# EAGLE schematic xio4_mez (EAGLE 9.4.2)

## Sheet 1 of 6: Block diagram
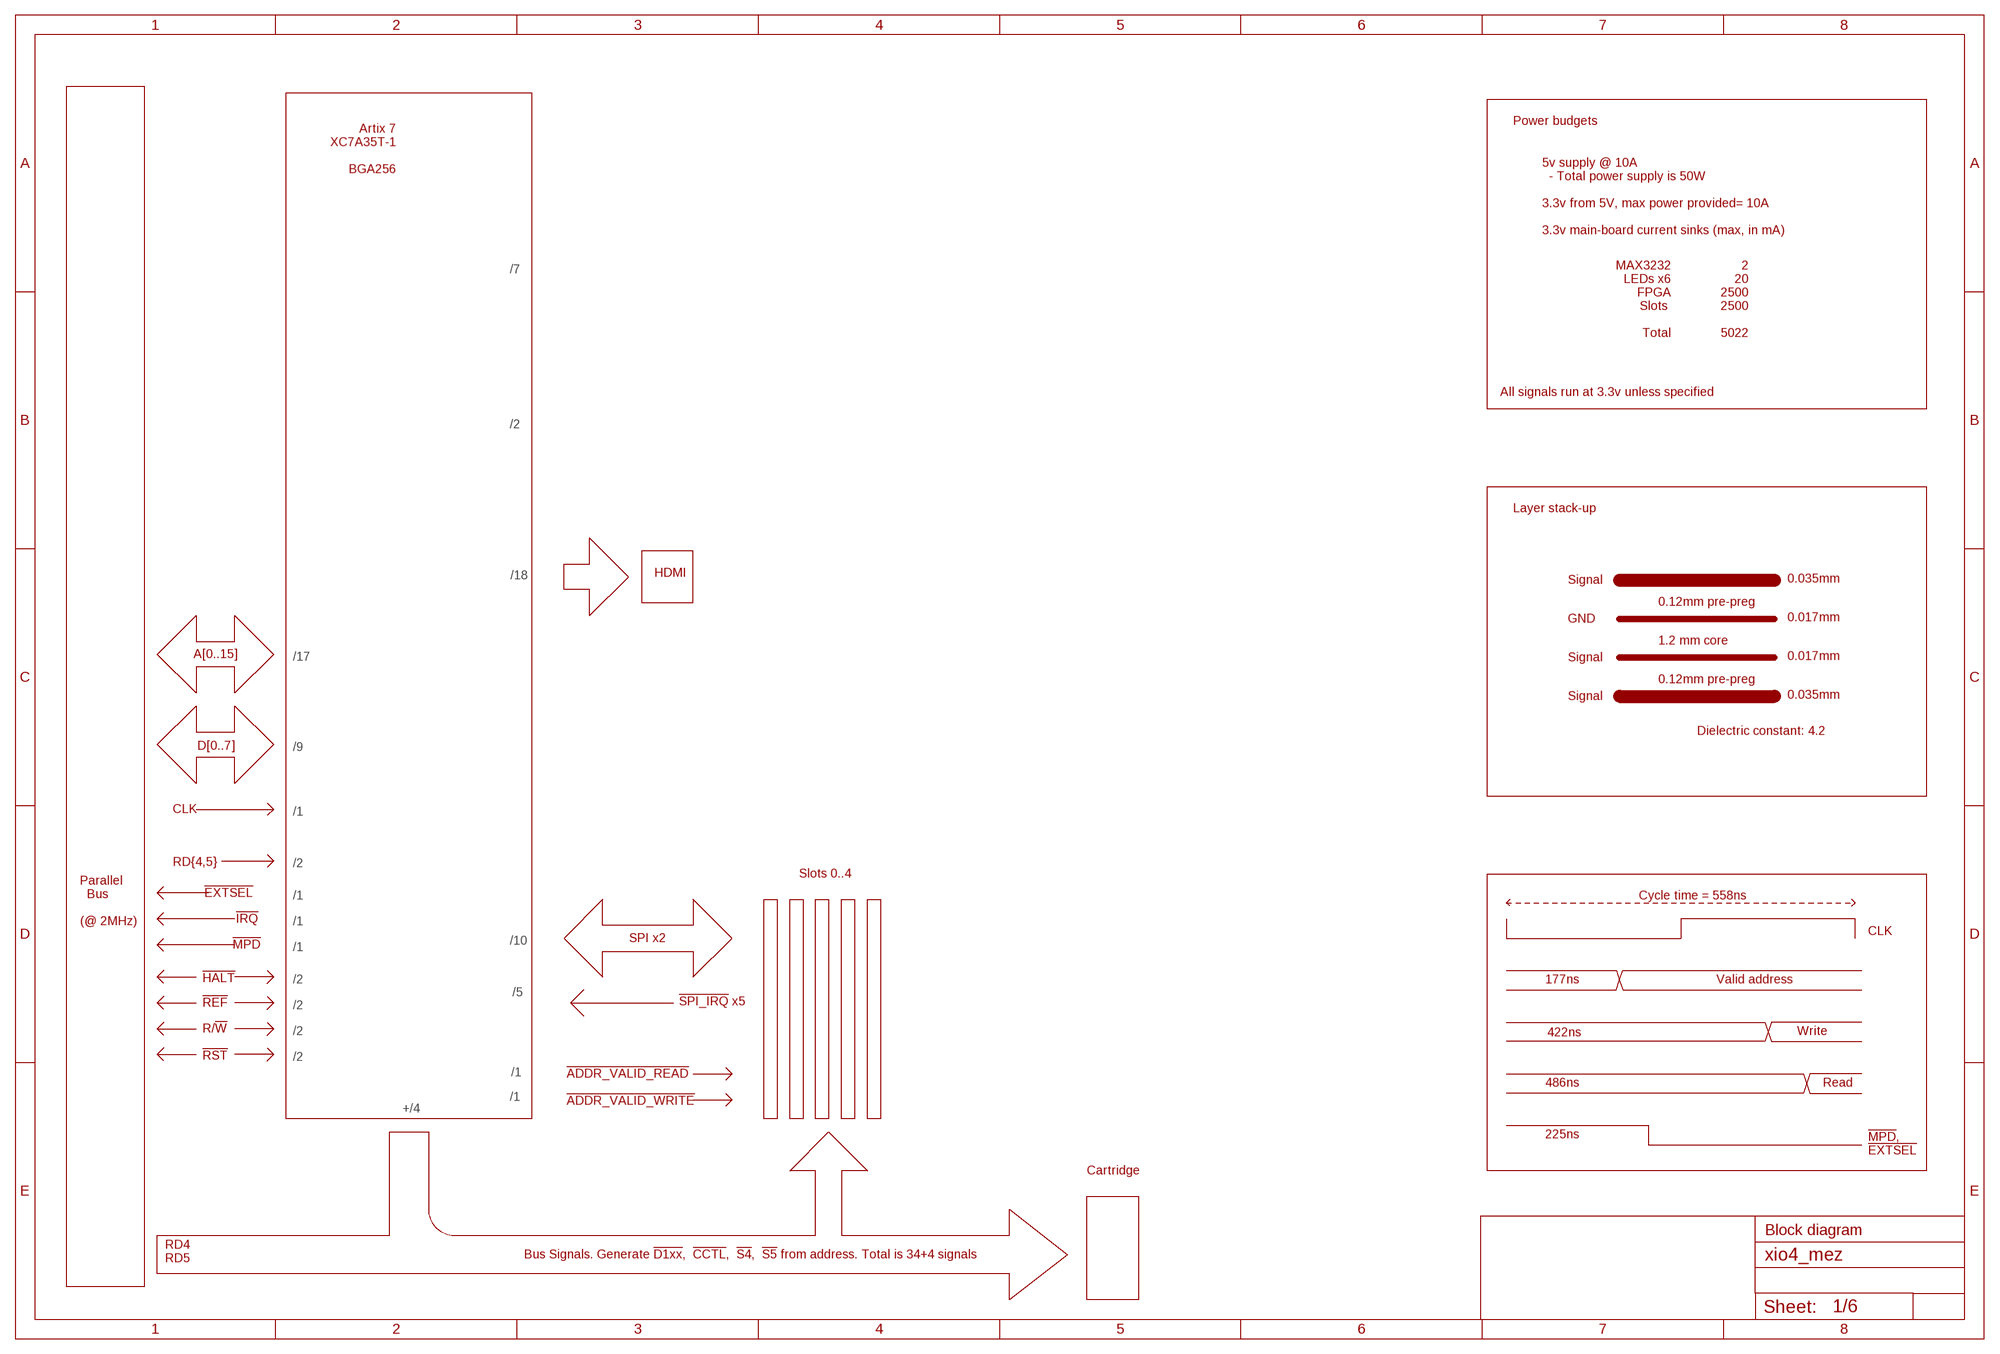
[diagram p0: schematic, sheet 1]

### Notes on the sheet
- Artix 7
      XC7A35T-1
  
   BGA256
- Power budgets
- 5v supply @ 10A
    - Total power supply is 50W
  
  3.3v from 5V, max power provided= 10A 
  
  3.3v main-board current sinks (max, in mA)
- MAX3232
  LEDs x6
  FPGA
  Slots 
  
  Total
- 2
  20
  2500
  2500
  
  5022
- /7
- All signals run at 3.3v unless specified
- /2
- Layer stack-up
- /18
- HDMI
- Signal | 0.035mm
- 0.12mm pre-preg
- GND | 0.017mm
- 1.2 mm core
- A[0..15] | /17 | Signal | 0.017mm
- 0.12mm pre-preg
- Signal | 0.035mm
- Dielectric constant: 4.2
- D[0..7] | /9
- CLK | /1
- RD{4,5} | /2
- Slots 0..4
- !EXTSEL!
- /1 | Cycle time = 558ns
- !IRQ!
- Parallel
    Bus
  
  (@ 2MHz)
- /1
- CLK
- !MPD! | SPI x2
- /10
- /1
- !HALT! | /2 | 177ns | Valid address
- /5
- !REF! | !SPI_IRQ! x5
- /2
- R/!W! | /2 | Write
- 422ns
- !RST! | /2
- /1 | !ADDR_VALID_READ!
- 486ns | Read
- /1
- !ADDR_VALID_WRITE!
- +/4
- 225ns
- !MPD!,
  !EXTSEL!
- Cartridge
- Block diagram
- Bus Signals. Generate !D1xx!,  !CCTL!,  !S4!,  !S5! from address. Total is 34+4 signals
- RD4
  RD5

## Sheet 2 of 6: High voltage signalling
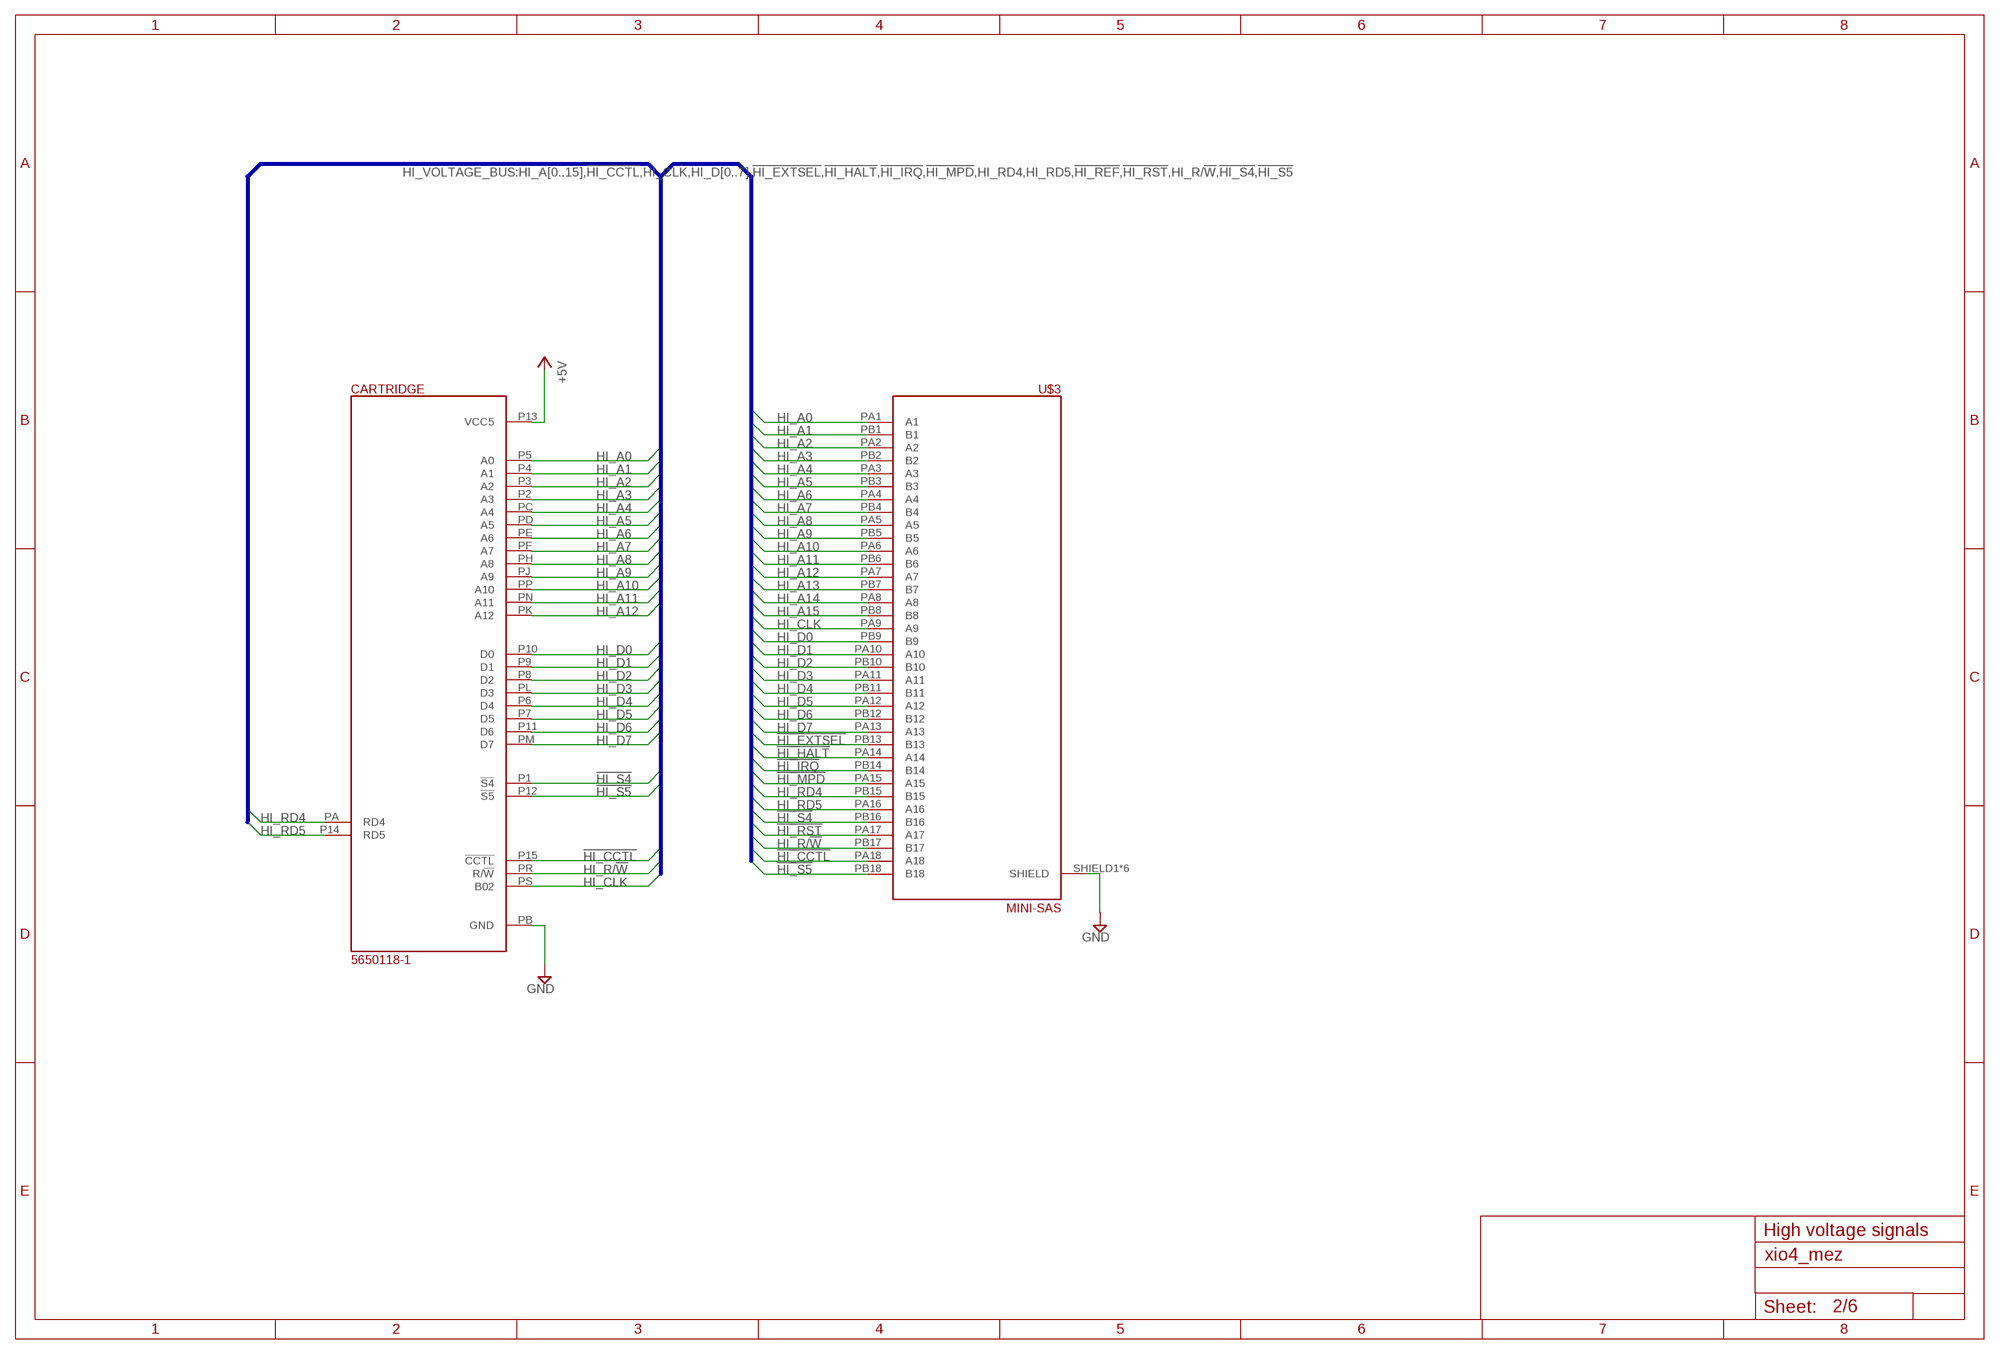
[diagram p1: schematic, sheet 2]

### Parts
CARTRIDGE  5650118-1  A8_CART  [A8_CART]
U$3  MINI-SAS  [MINI-SAS]

### Nets
!HI_CCTL!: CARTRIDGE.P15(!CCTL!) U$3.PA18(A18)
!HI_EXTSEL!: U$3.PB13(B13) ; also sheet 3
!HI_HALT!: U$3.PA14(A14) ; also sheet 3
!HI_IRQ!: U$3.PB14(B14) ; also sheet 3
!HI_MPD!: U$3.PA15(A15) ; also sheet 3
!HI_RST!: U$3.PA17(A17) ; also sheet 3
!HI_S4!: CARTRIDGE.P1(!S4!) U$3.PB16(B16)
!HI_S5!: CARTRIDGE.P12(!S5!) U$3.PB18(B18)
+5V: CARTRIDGE.P13(VCC5) ; also sheet 3,4,5,6
GND: CARTRIDGE.PB(GND) U$3.SHIELD1(SHIELD) U$3.SHIELD2(SHIELD) U$3.SHIELD3(SHIELD) U$3.SHIELD4(SHIELD) U$3.SHIELD5(SHIELD) U$3.SHIELD6(SHIELD) ; also sheet 3,4,5
HI_A0: CARTRIDGE.P5(A0) U$3.PA1(A1) ; also sheet 3
HI_A1: CARTRIDGE.P4(A1) U$3.PB1(B1) ; also sheet 3
HI_A2: CARTRIDGE.P3(A2) U$3.PA2(A2) ; also sheet 3
HI_A3: CARTRIDGE.P2(A3) U$3.PB2(B2) ; also sheet 3
HI_A4: CARTRIDGE.PC(A4) U$3.PA3(A3) ; also sheet 3
HI_A5: CARTRIDGE.PD(A5) U$3.PB3(B3) ; also sheet 3
HI_A6: CARTRIDGE.PE(A6) U$3.PA4(A4) ; also sheet 3
HI_A7: CARTRIDGE.PF(A7) U$3.PB4(B4) ; also sheet 3
HI_A8: CARTRIDGE.PH(A8) U$3.PA5(A5) ; also sheet 3
HI_A9: CARTRIDGE.PJ(A9) U$3.PB5(B5) ; also sheet 3
HI_A10: CARTRIDGE.PP(A10) U$3.PA6(A6) ; also sheet 3
HI_A11: CARTRIDGE.PN(A11) U$3.PB6(B6) ; also sheet 3
HI_A12: CARTRIDGE.PK(A12) U$3.PA7(A7) ; also sheet 3
HI_A13: U$3.PB7(B7) ; also sheet 3
HI_A14: U$3.PA8(A8) ; also sheet 3
HI_A15: U$3.PB8(B8) ; also sheet 3
HI_CLK: CARTRIDGE.PS(B02) U$3.PA9(A9) ; also sheet 3
HI_D0: CARTRIDGE.P10(D0) U$3.PB9(B9) ; also sheet 3
HI_D1: CARTRIDGE.P9(D1) U$3.PA10(A10) ; also sheet 3
HI_D2: CARTRIDGE.P8(D2) U$3.PB10(B10) ; also sheet 3
HI_D3: CARTRIDGE.PL(D3) U$3.PA11(A11) ; also sheet 3
HI_D4: CARTRIDGE.P6(D4) U$3.PB11(B11) ; also sheet 3
HI_D5: CARTRIDGE.P7(D5) U$3.PA12(A12) ; also sheet 3
HI_D6: CARTRIDGE.P11(D6) U$3.PB12(B12) ; also sheet 3
HI_D7: CARTRIDGE.PM(D7) U$3.PA13(A13) ; also sheet 3
HI_R/!W!: CARTRIDGE.PR(R/!W!) U$3.PB17(B17) ; also sheet 3
HI_RD4: CARTRIDGE.PA(RD4) U$3.PB15(B15) ; also sheet 3
HI_RD5: CARTRIDGE.P14(RD5) U$3.PA16(A16) ; also sheet 3

### Buses
HI_VOLTAGE_BUS:HI_A[0..15],!HI_CCTL!,HI_CLK,HI_D[0..7],!HI_EXTSEL!,!HI_HALT!,!HI_IRQ!,!HI_MPD!,HI_RD4,HI_RD5,!HI_REF!,!HI_RST!,HI_R/!W!,!HI_S4!,!HI_S5!

### Notes on the sheet
- High voltage signals

## Sheet 3 of 6: Level changers
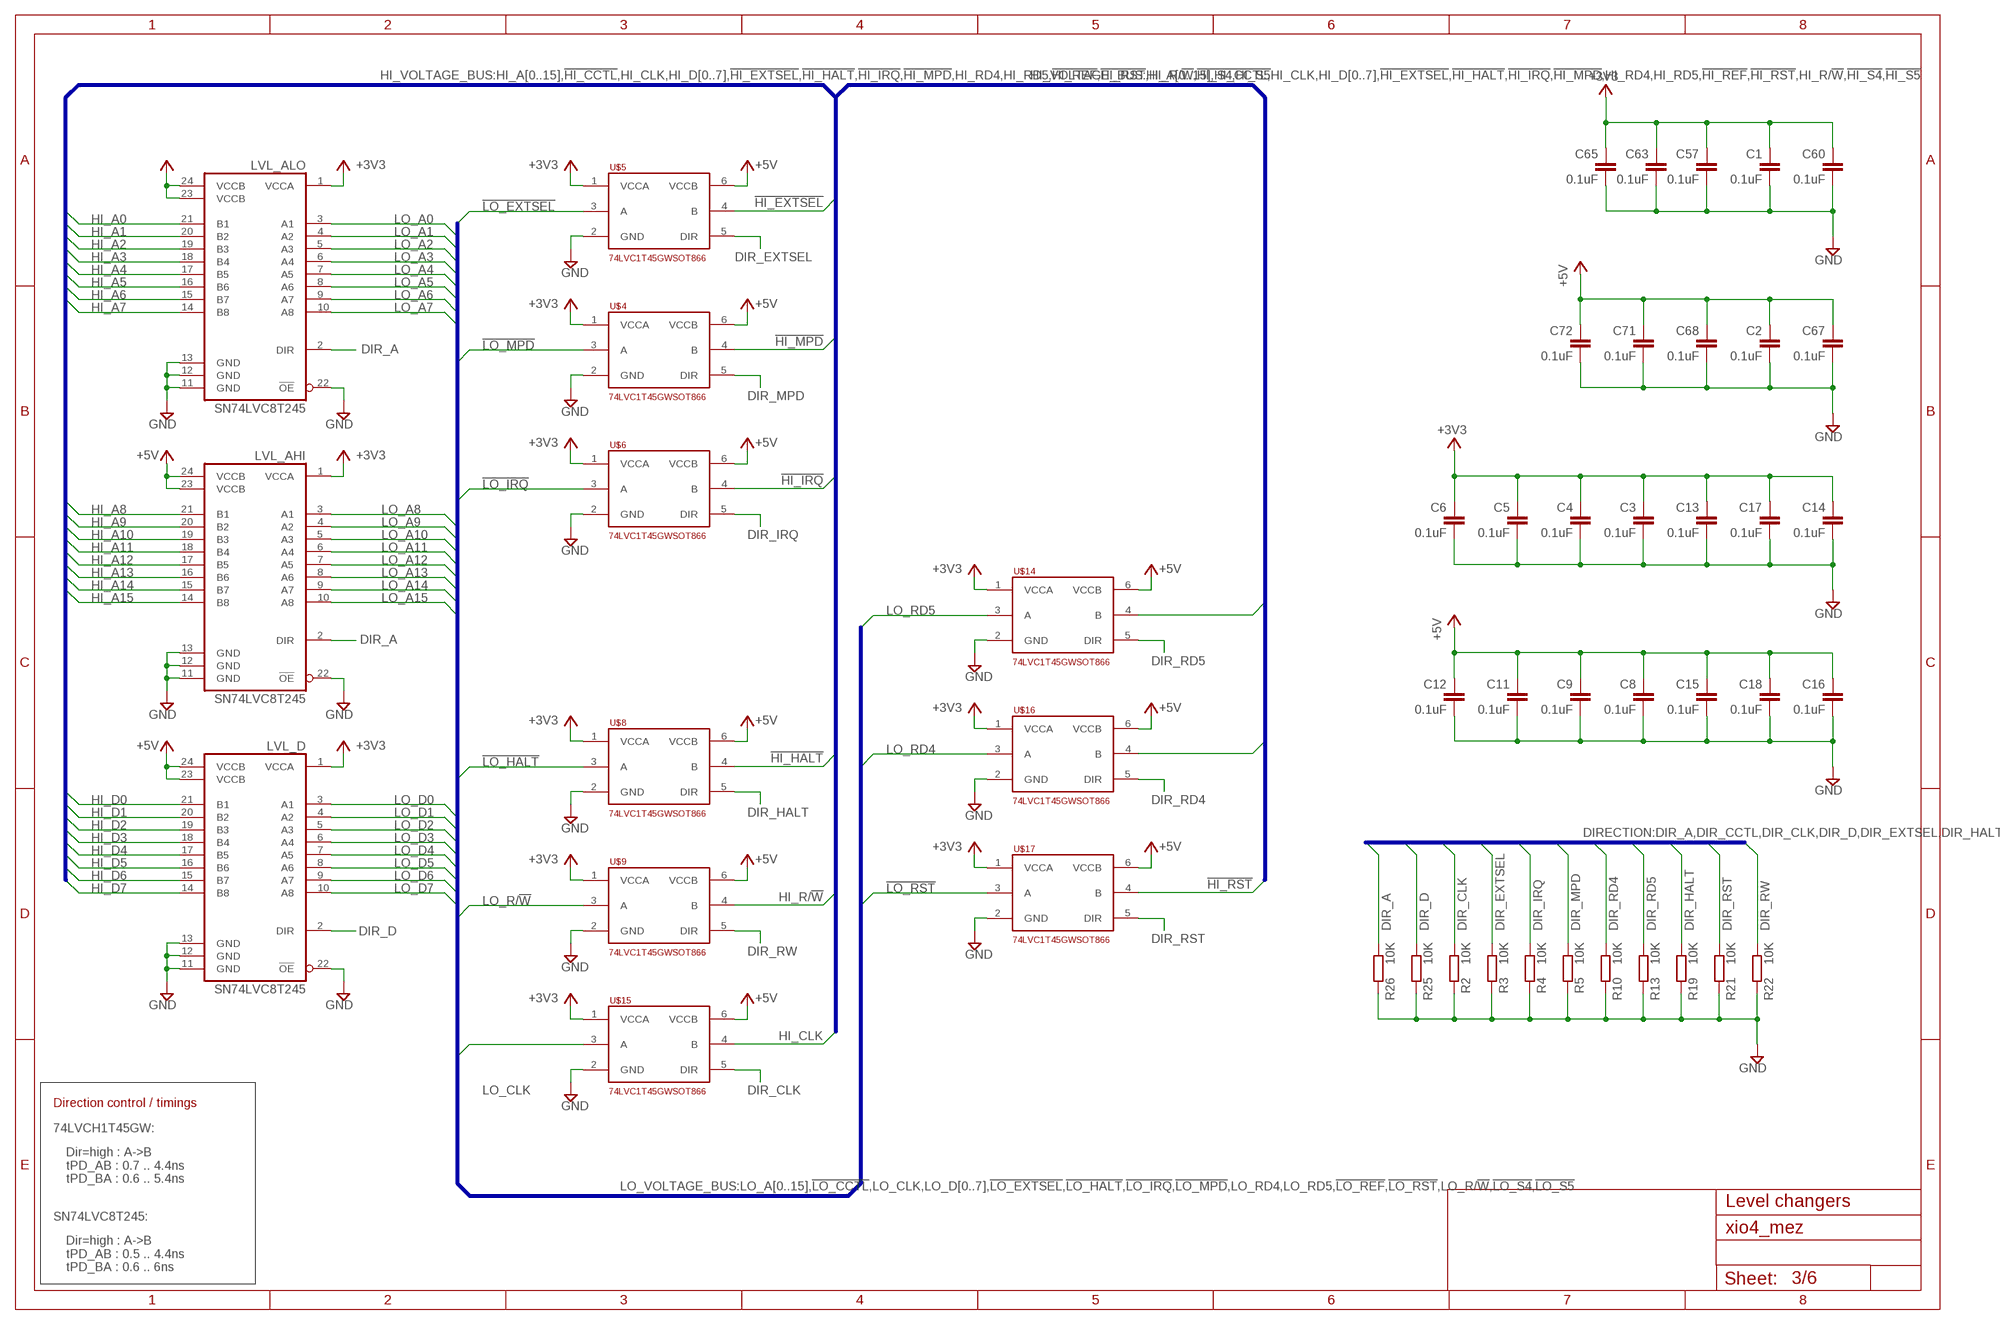
[diagram p2: schematic, sheet 3, part 1 of 2]
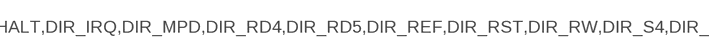
[diagram p3: schematic, sheet 3, part 2 of 2]

### Parts
C1  0.1uF  C-EUC0201  [C0201]
C2  0.1uF  C-EUC0201  [C0201]
C3  0.1uF  C-EUC0201  [C0201]
C4  0.1uF  C-EUC0201  [C0201]
C5  0.1uF  C-EUC0201  [C0201]
C6  0.1uF  C-EUC0201  [C0201]
C8  0.1uF  C-EUC0201  [C0201]
C9  0.1uF  C-EUC0201  [C0201]
C11  0.1uF  C-EUC0201  [C0201]
C12  0.1uF  C-EUC0201  [C0201]
C13  0.1uF  C-EUC0201  [C0201]
C14  0.1uF  C-EUC0201  [C0201]
C15  0.1uF  C-EUC0201  [C0201]
C16  0.1uF  C-EUC0201  [C0201]
C17  0.1uF  C-EUC0201  [C0201]
C18  0.1uF  C-EUC0201  [C0201]
C57  0.1uF  C-EUC0201  [C0201]
C60  0.1uF  C-EUC0201  [C0201]
C63  0.1uF  C-EUC0201  [C0201]
C65  0.1uF  C-EUC0201  [C0201]
C67  0.1uF  C-EUC0201  [C0201]
C68  0.1uF  C-EUC0201  [C0201]
C71  0.1uF  C-EUC0201  [C0201]
C72  0.1uF  C-EUC0201  [C0201]
LVL_AHI  SN74LVC8T245  [TSSOP24]
LVL_ALO  SN74LVC8T245  [TSSOP24]
LVL_D  SN74LVC8T245  [TSSOP24]
R2  10K  R-EU_R0201  [R0201]
R3  10K  R-EU_R0201  [R0201]
R4  10K  R-EU_R0201  [R0201]
R5  10K  R-EU_R0201  [R0201]
R10  10K  R-EU_R0201  [R0201]
R13  10K  R-EU_R0201  [R0201]
R19  10K  R-EU_R0201  [R0201]
R21  10K  R-EU_R0201  [R0201]
R22  10K  R-EU_R0201  [R0201]
R25  10K  R-EU_R0201  [R0201]
R26  10K  R-EU_R0201  [R0201]
U$4  74LVC1T45GWSOT866  [SOT886]
U$5  74LVC1T45GWSOT866  [SOT886]
U$6  74LVC1T45GWSOT866  [SOT886]
U$8  74LVC1T45GWSOT866  [SOT886]
U$9  74LVC1T45GWSOT866  [SOT886]
U$14  74LVC1T45GWSOT866  [SOT886]
U$15  74LVC1T45GWSOT866  [SOT886]
U$16  74LVC1T45GWSOT866  [SOT886]
U$17  74LVC1T45GWSOT866  [SOT886]

### Nets
!HI_EXTSEL!: U$5.4(B) ; also sheet 2
!HI_HALT!: U$8.4(B) ; also sheet 2
!HI_IRQ!: U$6.4(B) ; also sheet 2
!HI_MPD!: U$4.4(B) ; also sheet 2
!HI_RST!: U$17.4(B) ; also sheet 2
!LO_EXTSEL!: U$5.3(A) ; also sheet 6
!LO_HALT!: U$8.3(A) ; also sheet 6
!LO_IRQ!: U$6.3(A) ; also sheet 6
!LO_MPD!: U$4.3(A) ; also sheet 6
!LO_RST!: U$17.3(A) ; also sheet 6
+3V3 [lcd]: C1.1 C3.1 C4.1 C5.1 C6.1 C13.1 C14.1 C17.1 C57.1 C60.1 C63.1 C65.1 LVL_AHI.1(VCCA) LVL_ALO.1(VCCA) LVL_D.1(VCCA) U$4.1(VCCA) U$5.1(VCCA) U$6.1(VCCA) U$8.1(VCCA) U$9.1(VCCA) U$14.1(VCCA) U$15.1(VCCA) U$16.1(VCCA) U$17.1(VCCA)
+5V: C2.1 C8.1 C9.1 C11.1 C12.1 C15.1 C16.1 C18.1 C67.1 C68.1 C71.1 C72.1 LVL_AHI.23(VCCB) LVL_AHI.24(VCCB) LVL_ALO.23(VCCB) LVL_ALO.24(VCCB) LVL_D.23(VCCB) LVL_D.24(VCCB) U$4.6(VCCB) U$5.6(VCCB) U$6.6(VCCB) U$8.6(VCCB) U$9.6(VCCB) U$14.6(VCCB) U$15.6(VCCB) U$16.6(VCCB) U$17.6(VCCB) ; also sheet 2,4,5,6
DIR_A: LVL_AHI.2(DIR) LVL_ALO.2(DIR) R26.1 ; also sheet 5
DIR_CLK: R2.1 U$15.5(DIR) ; also sheet 5
DIR_D: LVL_D.2(DIR) R25.1 ; also sheet 5
DIR_EXTSEL: R3.1 U$5.5(DIR) ; also sheet 5
DIR_HALT: R19.1 U$8.5(DIR) ; also sheet 5
DIR_IRQ: R4.1 U$6.5(DIR) ; also sheet 5
DIR_MPD: R5.1 U$4.5(DIR) ; also sheet 5
DIR_RD4: R10.1 U$16.5(DIR) ; also sheet 5
DIR_RD5: R13.1 U$14.5(DIR) ; also sheet 5
DIR_RST: R21.1 U$17.5(DIR) ; also sheet 5
DIR_RW: R22.1 U$9.5(DIR) ; also sheet 5
GND: C1.2 C2.2 C3.2 C4.2 C5.2 C6.2 C8.2 C9.2 C11.2 C12.2 C13.2 C14.2 C15.2 C16.2 C17.2 C18.2 C57.2 C60.2 C63.2 C65.2 C67.2 C68.2 C71.2 C72.2 LVL_AHI.11(GND) LVL_AHI.12(GND) LVL_AHI.13(GND) LVL_AHI.22(!OE!) LVL_ALO.11(GND) LVL_ALO.12(GND) LVL_ALO.13(GND) LVL_ALO.22(!OE!) LVL_D.11(GND) LVL_D.12(GND) LVL_D.13(GND) LVL_D.22(!OE!) R2.2 R3.2 R4.2 R5.2 R10.2 R13.2 R19.2 R21.2 R22.2 R25.2 R26.2 U$4.2(GND) U$5.2(GND) U$6.2(GND) U$8.2(GND) U$9.2(GND) U$14.2(GND) U$15.2(GND) U$16.2(GND) U$17.2(GND) ; also sheet 2,4,5
HI_A0: LVL_ALO.21(B1) ; also sheet 2
HI_A1: LVL_ALO.20(B2) ; also sheet 2
HI_A2: LVL_ALO.19(B3) ; also sheet 2
HI_A3: LVL_ALO.18(B4) ; also sheet 2
HI_A4: LVL_ALO.17(B5) ; also sheet 2
HI_A5: LVL_ALO.16(B6) ; also sheet 2
HI_A6: LVL_ALO.15(B7) ; also sheet 2
HI_A7: LVL_ALO.14(B8) ; also sheet 2
HI_A8: LVL_AHI.21(B1) ; also sheet 2
HI_A9: LVL_AHI.20(B2) ; also sheet 2
HI_A10: LVL_AHI.19(B3) ; also sheet 2
HI_A11: LVL_AHI.18(B4) ; also sheet 2
HI_A12: LVL_AHI.17(B5) ; also sheet 2
HI_A13: LVL_AHI.16(B6) ; also sheet 2
HI_A14: LVL_AHI.15(B7) ; also sheet 2
HI_A15: LVL_AHI.14(B8) ; also sheet 2
HI_CLK: U$15.4(B) ; also sheet 2
HI_D0: LVL_D.21(B1) ; also sheet 2
HI_D1: LVL_D.20(B2) ; also sheet 2
HI_D2: LVL_D.19(B3) ; also sheet 2
HI_D3: LVL_D.18(B4) ; also sheet 2
HI_D4: LVL_D.17(B5) ; also sheet 2
HI_D5: LVL_D.16(B6) ; also sheet 2
HI_D6: LVL_D.15(B7) ; also sheet 2
HI_D7: LVL_D.14(B8) ; also sheet 2
HI_R/!W!: U$9.4(B) ; also sheet 2
HI_RD4: U$16.4(B) ; also sheet 2
HI_RD5: U$14.4(B) ; also sheet 2
LO_A0: LVL_ALO.3(A1) ; also sheet 6
LO_A1: LVL_ALO.4(A2) ; also sheet 6
LO_A2: LVL_ALO.5(A3) ; also sheet 6
LO_A3: LVL_ALO.6(A4) ; also sheet 6
LO_A4: LVL_ALO.7(A5) ; also sheet 6
LO_A5: LVL_ALO.8(A6) ; also sheet 6
LO_A6: LVL_ALO.9(A7) ; also sheet 6
LO_A7: LVL_ALO.10(A8) ; also sheet 6
LO_A8: LVL_AHI.3(A1) ; also sheet 6
LO_A9: LVL_AHI.4(A2) ; also sheet 6
LO_A10: LVL_AHI.5(A3) ; also sheet 6
LO_A11: LVL_AHI.6(A4) ; also sheet 6
LO_A12: LVL_AHI.7(A5) ; also sheet 6
LO_A13: LVL_AHI.8(A6) ; also sheet 6
LO_A14: LVL_AHI.9(A7) ; also sheet 6
LO_A15: LVL_AHI.10(A8) ; also sheet 6
LO_CLK: U$15.3(A) ; also sheet 6
LO_D0: LVL_D.3(A1) ; also sheet 6
LO_D1: LVL_D.4(A2) ; also sheet 6
LO_D2: LVL_D.5(A3) ; also sheet 6
LO_D3: LVL_D.6(A4) ; also sheet 6
LO_D4: LVL_D.7(A5) ; also sheet 6
LO_D5: LVL_D.8(A6) ; also sheet 6
LO_D6: LVL_D.9(A7) ; also sheet 6
LO_D7: LVL_D.10(A8) ; also sheet 6
LO_R/!W!: U$9.3(A) ; also sheet 6
LO_RD4: U$16.3(A) ; also sheet 6
LO_RD5: U$14.3(A) ; also sheet 6

### Buses
HI_VOLTAGE_BUS:HI_A[0..15],!HI_CCTL!,HI_CLK,HI_D[0..7],!HI_EXTSEL!,!HI_HALT!,!HI_IRQ!,!HI_MPD!,HI_RD4,HI_RD5,!HI_REF!,!HI_RST!,HI_R/!W!,!HI_S4!,!HI_S5!
LO_VOLTAGE_BUS:LO_A[0..15],!LO_CCTL!,LO_CLK,LO_D[0..7],!LO_EXTSEL!,!LO_HALT!,!LO_IRQ!,!LO_MPD!,LO_RD4,LO_RD5,!LO_REF!,!LO_RST!,LO_R/!W!,!LO_S4!,!LO_S5!
DIRECTION:DIR_A,DIR_CCTL,DIR_CLK,DIR_D,DIR_EXTSEL,DIR_HALT,DIR_IRQ,DIR_MPD,DIR_RD4,DIR_RD5,DIR_REF,DIR_RST,DIR_RW,DIR_S4,DIR_S5

### Notes on the sheet
- Direction control / timings
- 74LVCH1T45GW:
- Dir=high : A->B
  tPD_AB : 0.7 .. 4.4ns
  tPD_BA : 0.6 .. 5.4ns
- Level changers
- SN74LVC8T245:
- Dir=high : A->B
  tPD_AB : 0.5 .. 4.4ns
  tPD_BA : 0.6 .. 6ns

## Sheet 4 of 6: Video out
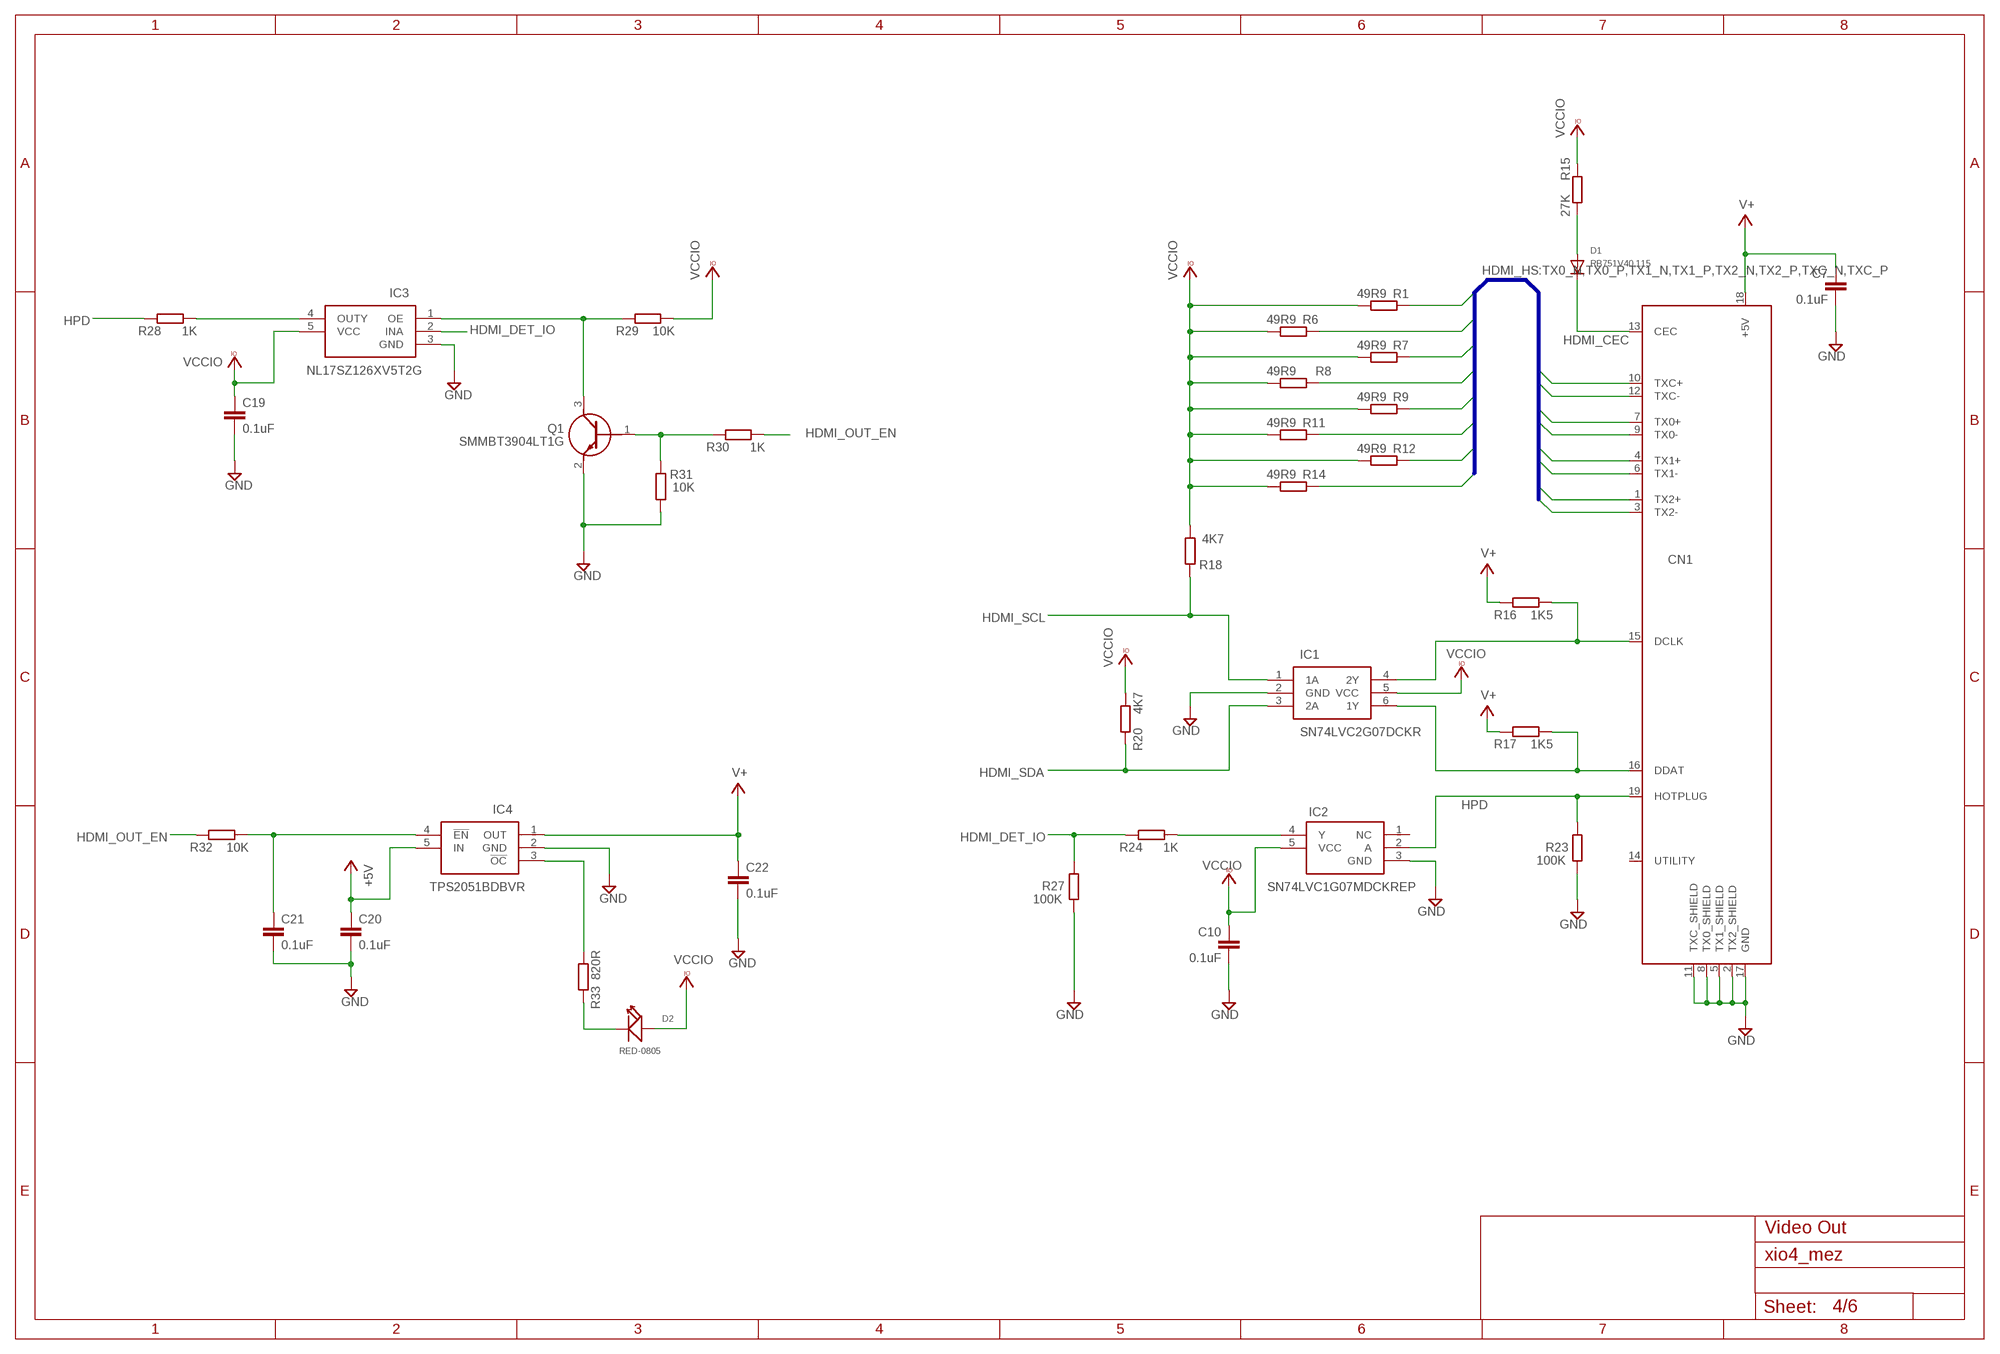
[diagram p4: schematic, sheet 4]

### Parts
C7  0.1uF  C-EUC0201  [C0201]
C10  0.1uF  C-EUC0201  [C0201]
C19  0.1uF  C-EUC0201  [C0201]
C20  0.1uF  C-EUC0201  [C0201]
C21  0.1uF  C-EUC0201  [C0201]
C22  0.1uF  C-EUC0201  [C0201]
CN1  HDMI_MOLEX_47151-0001  [HDMI_MOLEX_47151-0001]
D1  RB751V40,115  DIODESOD-323  [SOD-323]
D2  RED-0805  SMD-LED-CLEAR-RED(0805)  [LED-0805]
IC1  SN74LVC2G07DCKR  [SOT65P210X110X6N]
IC2  SN74LVC1G07MDCKREP  [SOT65P210X110-5N]
IC3  NL17SZ126XV5T2G  [SOTFL50P160X60-5N]
IC4  TPS2051BDBVR  [SOT95P280X145-5N]
Q1  SMMBT3904LT1G  [SOT96P237X111-3N]
R1  49R9  R-EU_R0201  [R0201]
R6  49R9  R-EU_R0201  [R0201]
R7  49R9  R-EU_R0201  [R0201]
R8  49R9  R-EU_R0201  [R0201]
R9  49R9  R-EU_R0201  [R0201]
R11  49R9  R-EU_R0201  [R0201]
R12  49R9  R-EU_R0201  [R0201]
R14  49R9  R-EU_R0201  [R0201]
R15  27K  R-EU_R0201  [R0201]
R16  1K5  R-EU_R0201  [R0201]
R17  1K5  R-EU_R0201  [R0201]
R18  4K7  R-EU_R0201  [R0201]
R20  4K7  R-EU_R0201  [R0201]
R23  100K  R-EU_R0201  [R0201]
R24  1K  R-EU_R0201  [R0201]
R27  100K  R-EU_R0201  [R0201]
R28  1K  R-EU_R0201  [R0201]
R29  10K  R-EU_R0201  [R0201]
R30  1K  R-EU_R0201  [R0201]
R31  10K  R-EU_R0201  [R0201]
R32  10K  R-EU_R0201  [R0201]
R33  820R  R-EU_R0201  [R0201]

### Nets
+5V: C20.1 IC4.5(IN) ; also sheet 2,3,5,6
GND: C7.2 C10.2 C19.2 C20.2 C21.2 C22.2 CN1.2(TX2_SHIELD) CN1.5(TX1_SHIELD) CN1.8(TX0_SHIELD) CN1.11(TXC_SHIELD) CN1.17(GND) IC1.2(GND) IC2.3(GND) IC3.3(GND) IC4.2(GND) Q1.2(E) R23.1 R27.1 R31.2 ; also sheet 2,3,5
HDMI_CEC: CN1.13(CEC) D1.C
HDMI_DET_IO: IC3.2(INA) R24.2 R27.2 ; also sheet 5
HDMI_OUT_EN: R30.1 R32.2 ; also sheet 5
HDMI_SCL: IC1.1(1A) R18.2 ; also sheet 5
HDMI_SDA: IC1.3(2A) R20.2 ; also sheet 5
HPD: CN1.19(HOTPLUG) IC2.2(A) R23.2 R28.2
N$1: CN1.16(DDAT) IC1.6(1Y) R17.1
N$2: D1.A R15.1
N$3: CN1.15(DCLK) IC1.4(2Y) R16.1
N$4: IC3.1(OE) Q1.3(C) R29.2
N$5: IC2.4(Y) R24.1
N$6: IC3.4(OUTY) R28.1
N$7: Q1.1(B) R30.2 R31.1
N$8: C21.1 IC4.4(!EN) R32.1
N$9: IC4.3(!OC) R33.1
N$10: D2.- R33.2
TX0_N [tx100]: CN1.9(TX0-) R1.2 ; also sheet 5
TX0_P [tx100]: CN1.7(TX0+) R6.2 ; also sheet 5
TX1_N [tx100]: CN1.6(TX1-) R7.2 ; also sheet 5
TX1_P [tx100]: CN1.4(TX1+) R8.2 ; also sheet 5
TX2_N [tx100]: CN1.3(TX2-) R9.2 ; also sheet 5
TX2_P [tx100]: CN1.1(TX2+) R11.2 ; also sheet 5
TXC_N [tx100]: CN1.12(TXC-) R12.2 ; also sheet 5
TXC_P [tx100]: CN1.10(TXC+) R14.2 ; also sheet 5
V+: C7.1 C22.1 CN1.18(+5V) IC4.1(OUT) R16.2 R17.2
VCCIO: C10.1 C19.1 D2.+ IC1.5(VCC) IC2.5(VCC) IC3.5(VCC) R1.1 R6.1 R7.1 R8.1 R9.1 R11.1 R12.1 R14.1 R15.2 R18.1 R20.1 R29.1 ; also sheet 5
Unconnected: CN1.14(UTILITY) IC2.1(NC)

### Buses
HDMI_HS:TX0_N,TX0_P,TX1_N,TX1_P,TX2_N,TX2_P,TXC_N,TXC_P

### Notes on the sheet
- Video Out

## Sheet 5 of 6: FPGA
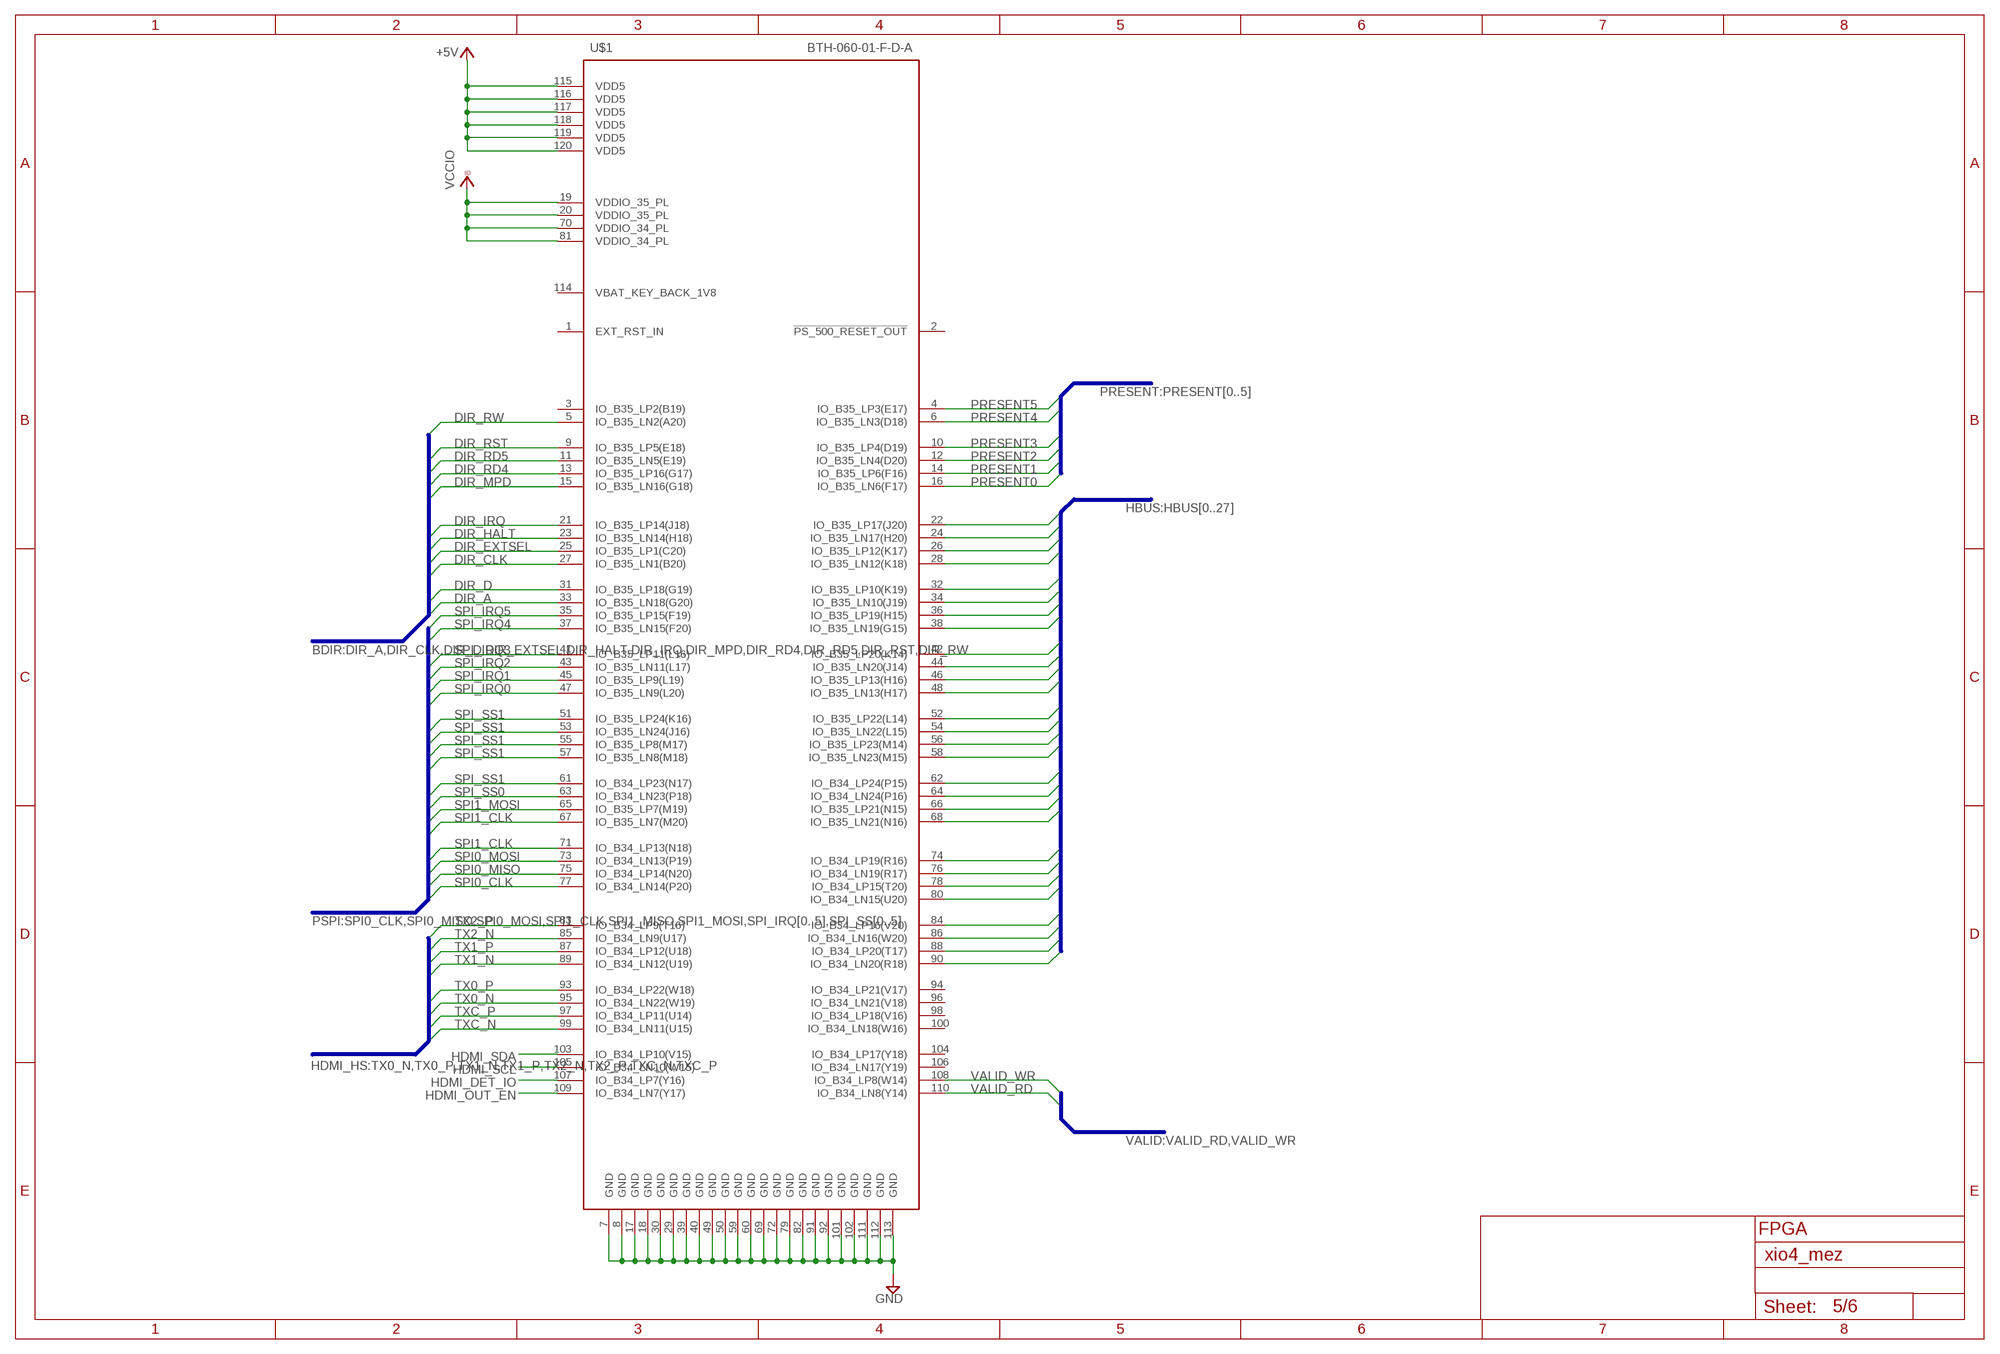
[diagram p5: schematic, sheet 5]

### Parts
U$1  BTH-060-01-F-D-A  [BTH-060-01-F-D-A]

### Nets
+5V: U$1.115(VDD5) U$1.116(VDD5) U$1.117(VDD5) U$1.118(VDD5) U$1.119(VDD5) U$1.120(VDD5) ; also sheet 2,3,4,6
DIR_A: U$1.33(IO_B35_LN18(G20)) ; also sheet 3
DIR_CLK: U$1.27(IO_B35_LN1(B20)) ; also sheet 3
DIR_D: U$1.31(IO_B35_LP18(G19)) ; also sheet 3
DIR_EXTSEL: U$1.25(IO_B35_LP1(C20)) ; also sheet 3
DIR_HALT: U$1.23(IO_B35_LN14(H18)) ; also sheet 3
DIR_IRQ: U$1.21(IO_B35_LP14(J18)) ; also sheet 3
DIR_MPD: U$1.15(IO_B35_LN16(G18)) ; also sheet 3
DIR_RD4: U$1.13(IO_B35_LP16(G17)) ; also sheet 3
DIR_RD5: U$1.11(IO_B35_LN5(E19)) ; also sheet 3
DIR_RST: U$1.9(IO_B35_LP5(E18)) ; also sheet 3
DIR_RW: U$1.5(IO_B35_LN2(A20)) ; also sheet 3
GND: U$1.7(GND) U$1.8(GND) U$1.17(GND) U$1.18(GND) U$1.29(GND) U$1.30(GND) U$1.39(GND) U$1.40(GND) U$1.49(GND) U$1.50(GND) U$1.59(GND) U$1.60(GND) U$1.69(GND) U$1.72(GND) U$1.79(GND) U$1.82(GND) U$1.91(GND) U$1.92(GND) U$1.101(GND) U$1.102(GND) U$1.111(GND) U$1.112(GND) U$1.113(GND) ; also sheet 2,3,4
HBUS0: U$1.22(IO_B35_LP17(J20)) ; also sheet 6
HBUS1: U$1.24(IO_B35_LN17(H20)) ; also sheet 6
HBUS2: U$1.26(IO_B35_LP12(K17)) ; also sheet 6
HBUS3: U$1.28(IO_B35_LN12(K18)) ; also sheet 6
HBUS4: U$1.32(IO_B35_LP10(K19)) ; also sheet 6
HBUS5: U$1.34(IO_B35_LN10(J19)) ; also sheet 6
HBUS6: U$1.36(IO_B35_LP19(H15)) ; also sheet 6
HBUS7: U$1.38(IO_B35_LN19(G15)) ; also sheet 6
HBUS8: U$1.42(IO_B35_LP20(K14)) ; also sheet 6
HBUS9: U$1.44(IO_B35_LN20(J14)) ; also sheet 6
HBUS10: U$1.46(IO_B35_LP13(H16)) ; also sheet 6
HBUS11: U$1.48(IO_B35_LN13(H17)) ; also sheet 6
HBUS12: U$1.52(IO_B35_LP22(L14)) ; also sheet 6
HBUS13: U$1.54(IO_B35_LN22(L15)) ; also sheet 6
HBUS14: U$1.56(IO_B35_LP23(M14)) ; also sheet 6
HBUS15: U$1.58(IO_B35_LN23(M15)) ; also sheet 6
HBUS16: U$1.62(IO_B34_LP24(P15)) ; also sheet 6
HBUS17: U$1.64(IO_B34_LN24(P16)) ; also sheet 6
HBUS18: U$1.66(IO_B35_LP21(N15)) ; also sheet 6
HBUS19: U$1.68(IO_B35_LN21(N16)) ; also sheet 6
HBUS20: U$1.74(IO_B34_LP19(R16)) ; also sheet 6
HBUS21: U$1.76(IO_B34_LN19(R17)) ; also sheet 6
HBUS22: U$1.78(IO_B34_LP15(T20)) ; also sheet 6
HBUS23: U$1.80(IO_B34_LN15(U20)) ; also sheet 6
HBUS24: U$1.84(IO_B34_LP16(V20)) ; also sheet 6
HBUS25: U$1.86(IO_B34_LN16(W20)) ; also sheet 6
HBUS26: U$1.88(IO_B34_LP20(T17)) ; also sheet 6
HBUS27: U$1.90(IO_B34_LN20(R18)) ; also sheet 6
HDMI_DET_IO: U$1.107(IO_B34_LP7(Y16)) ; also sheet 4
HDMI_OUT_EN: U$1.109(IO_B34_LN7(Y17)) ; also sheet 4
HDMI_SCL: U$1.105(IO_B34_LN10(W15)) ; also sheet 4
HDMI_SDA: U$1.103(IO_B34_LP10(V15)) ; also sheet 4
PRESENT0: U$1.16(IO_B35_LN6(F17)) ; also sheet 6
PRESENT1: U$1.14(IO_B35_LP6(F16)) ; also sheet 6
PRESENT2: U$1.12(IO_B35_LN4(D20)) ; also sheet 6
PRESENT3: U$1.10(IO_B35_LP4(D19)) ; also sheet 6
PRESENT4: U$1.6(IO_B35_LN3(D18)) ; also sheet 6
PRESENT5: U$1.4(IO_B35_LP3(E17)) ; also sheet 6
SPI0_CLK: U$1.77(IO_B34_LN14(P20)) ; also sheet 6
SPI0_MISO: U$1.75(IO_B34_LP14(N20)) ; also sheet 6
SPI0_MOSI: U$1.73(IO_B34_LN13(P19)) ; also sheet 6
SPI1_CLK: U$1.71(IO_B34_LP13(N18)) ; also sheet 6
SPI1_MISO: U$1.67(IO_B35_LN7(M20)) ; also sheet 6
SPI1_MOSI: U$1.65(IO_B35_LP7(M19)) ; also sheet 6
SPI_IRQ0: U$1.47(IO_B35_LN9(L20)) ; also sheet 6
SPI_IRQ1: U$1.45(IO_B35_LP9(L19)) ; also sheet 6
SPI_IRQ2: U$1.43(IO_B35_LN11(L17)) ; also sheet 6
SPI_IRQ3: U$1.41(IO_B35_LP11(L16)) ; also sheet 6
SPI_IRQ4: U$1.37(IO_B35_LN15(F20)) ; also sheet 6
SPI_IRQ5: U$1.35(IO_B35_LP15(F19)) ; also sheet 6
SPI_SS0: U$1.63(IO_B34_LN23(P18)) ; also sheet 6
SPI_SS1: U$1.61(IO_B34_LP23(N17)) ; also sheet 6
SPI_SS2: U$1.57(IO_B35_LN8(M18)) ; also sheet 6
SPI_SS3: U$1.55(IO_B35_LP8(M17)) ; also sheet 6
SPI_SS4: U$1.53(IO_B35_LN24(J16)) ; also sheet 6
SPI_SS5: U$1.51(IO_B35_LP24(K16)) ; also sheet 6
TX0_N [tx100]: U$1.95(IO_B34_LN22(W19)) ; also sheet 4
TX0_P [tx100]: U$1.93(IO_B34_LP22(W18)) ; also sheet 4
TX1_N [tx100]: U$1.89(IO_B34_LN12(U19)) ; also sheet 4
TX1_P [tx100]: U$1.87(IO_B34_LP12(U18)) ; also sheet 4
TX2_N [tx100]: U$1.85(IO_B34_LN9(U17)) ; also sheet 4
TX2_P [tx100]: U$1.83(IO_B34_LP9(T16)) ; also sheet 4
TXC_N [tx100]: U$1.99(IO_B34_LN11(U15)) ; also sheet 4
TXC_P [tx100]: U$1.97(IO_B34_LP11(U14)) ; also sheet 4
VALID_RD: U$1.110(IO_B34_LN8(Y14)) ; also sheet 6
VALID_WR: U$1.108(IO_B34_LP8(W14)) ; also sheet 6
VCCIO: U$1.19(VDDIO_35_PL) U$1.20(VDDIO_35_PL) U$1.70(VDDIO_34_PL) U$1.81(VDDIO_34_PL) ; also sheet 4
Unconnected: U$1.1(EXT_RST_IN) U$1.2(!PS_500_RESET_OUT!) U$1.3(IO_B35_LP2(B19)) U$1.94(IO_B34_LP21(V17)) U$1.96(IO_B34_LN21(V18)) U$1.98(IO_B34_LP18(V16)) U$1.100(IO_B34_LN18(W16)) U$1.104(IO_B34_LP17(Y18)) U$1.106(IO_B34_LN17(Y19)) U$1.114(VBAT_KEY_BACK_1V8)

### Buses
HDMI_HS:TX0_N,TX0_P,TX1_N,TX1_P,TX2_N,TX2_P,TXC_N,TXC_P
PSPI:SPI0_CLK,SPI0_MISO,SPI0_MOSI,SPI1_CLK,SPI1_MISO,SPI1_MOSI,SPI_IRQ[0..5],SPI_SS[0..5]
BDIR:DIR_A,DIR_CLK,DIR_D,DIR_EXTSEL,DIR_HALT,DIR_IRQ,DIR_MPD,DIR_RD4,DIR_RD5,DIR_RST,DIR_RW
PRESENT:PRESENT[0..5]
VALID:VALID_RD,VALID_WR
HBUS:HBUS[0..27]

### Notes on the sheet
- FPGA

## Sheet 6 of 6
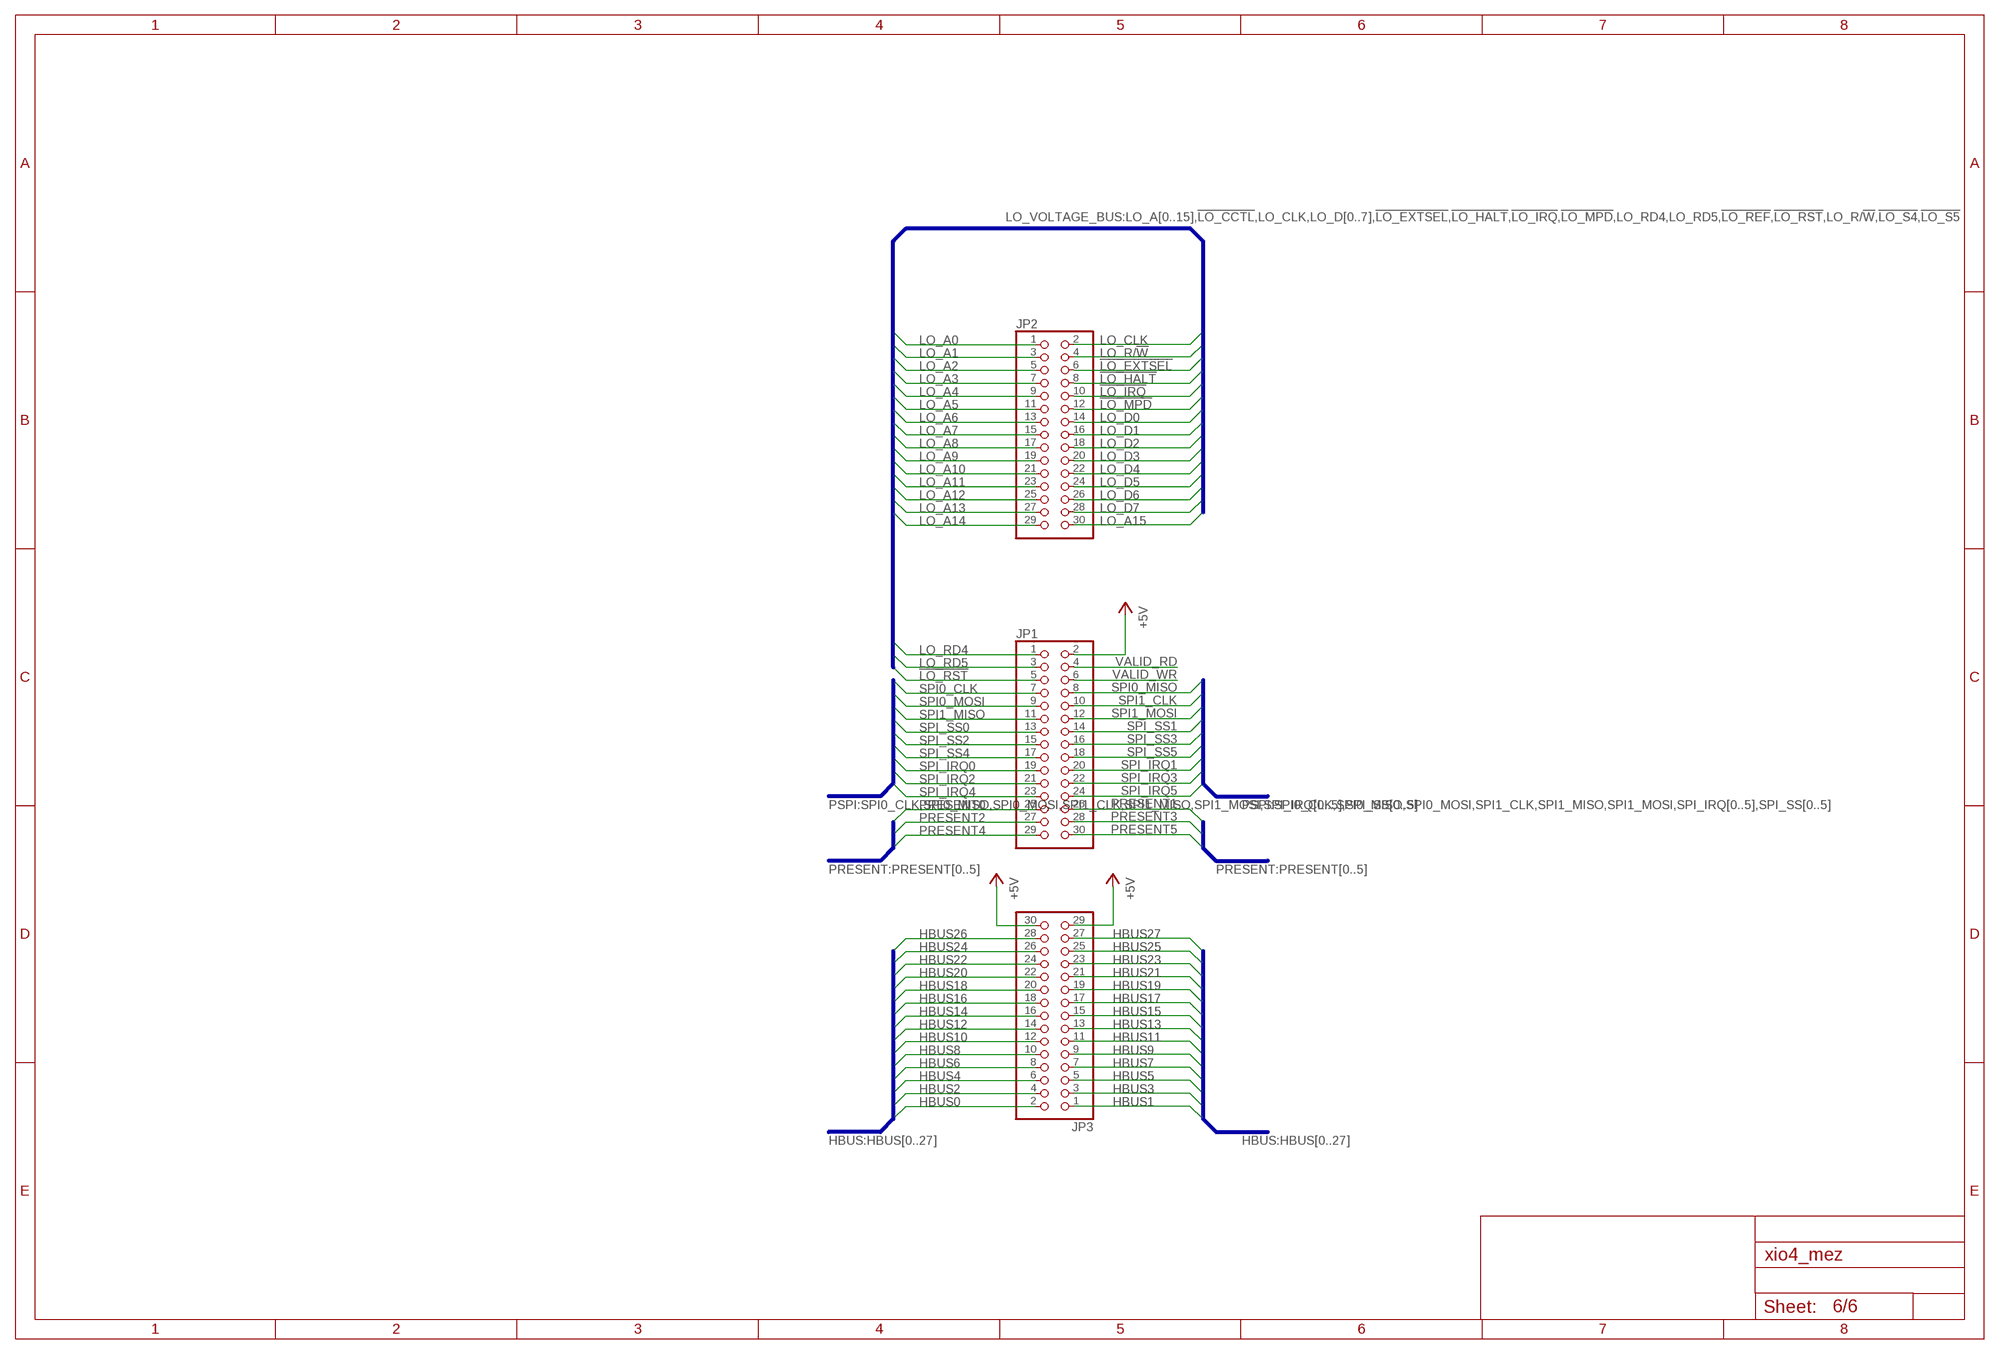
[diagram p6: schematic, sheet 6]

### Parts
JP1  PINHD-2X15_2.54-SMD  [2X15SMD]
JP2  PINHD-2X15_2.54-SMD  [2X15SMD]
JP3  PINHD-2X15_2.54-SMD  [2X15SMD]

### Nets
!LO_EXTSEL!: JP2.6 ; also sheet 3
!LO_HALT!: JP2.8 ; also sheet 3
!LO_IRQ!: JP2.10 ; also sheet 3
!LO_MPD!: JP2.12 ; also sheet 3
!LO_RST!: JP1.5 ; also sheet 3
+5V: JP1.2 JP3.29 JP3.30 ; also sheet 2,3,4,5
HBUS0: JP3.2 ; also sheet 5
HBUS1: JP3.1 ; also sheet 5
HBUS2: JP3.4 ; also sheet 5
HBUS3: JP3.3 ; also sheet 5
HBUS4: JP3.6 ; also sheet 5
HBUS5: JP3.5 ; also sheet 5
HBUS6: JP3.8 ; also sheet 5
HBUS7: JP3.7 ; also sheet 5
HBUS8: JP3.10 ; also sheet 5
HBUS9: JP3.9 ; also sheet 5
HBUS10: JP3.12 ; also sheet 5
HBUS11: JP3.11 ; also sheet 5
HBUS12: JP3.14 ; also sheet 5
HBUS13: JP3.13 ; also sheet 5
HBUS14: JP3.16 ; also sheet 5
HBUS15: JP3.15 ; also sheet 5
HBUS16: JP3.18 ; also sheet 5
HBUS17: JP3.17 ; also sheet 5
HBUS18: JP3.20 ; also sheet 5
HBUS19: JP3.19 ; also sheet 5
HBUS20: JP3.22 ; also sheet 5
HBUS21: JP3.21 ; also sheet 5
HBUS22: JP3.24 ; also sheet 5
HBUS23: JP3.23 ; also sheet 5
HBUS24: JP3.26 ; also sheet 5
HBUS25: JP3.25 ; also sheet 5
HBUS26: JP3.28 ; also sheet 5
HBUS27: JP3.27 ; also sheet 5
LO_A0: JP2.1 ; also sheet 3
LO_A1: JP2.3 ; also sheet 3
LO_A2: JP2.5 ; also sheet 3
LO_A3: JP2.7 ; also sheet 3
LO_A4: JP2.9 ; also sheet 3
LO_A5: JP2.11 ; also sheet 3
LO_A6: JP2.13 ; also sheet 3
LO_A7: JP2.15 ; also sheet 3
LO_A8: JP2.17 ; also sheet 3
LO_A9: JP2.19 ; also sheet 3
LO_A10: JP2.21 ; also sheet 3
LO_A11: JP2.23 ; also sheet 3
LO_A12: JP2.25 ; also sheet 3
LO_A13: JP2.27 ; also sheet 3
LO_A14: JP2.29 ; also sheet 3
LO_A15: JP2.30 ; also sheet 3
LO_CLK: JP2.2 ; also sheet 3
LO_D0: JP2.14 ; also sheet 3
LO_D1: JP2.16 ; also sheet 3
LO_D2: JP2.18 ; also sheet 3
LO_D3: JP2.20 ; also sheet 3
LO_D4: JP2.22 ; also sheet 3
LO_D5: JP2.24 ; also sheet 3
LO_D6: JP2.26 ; also sheet 3
LO_D7: JP2.28 ; also sheet 3
LO_R/!W!: JP2.4 ; also sheet 3
LO_RD4: JP1.1 ; also sheet 3
LO_RD5: JP1.3 ; also sheet 3
PRESENT0: JP1.25 ; also sheet 5
PRESENT1: JP1.26 ; also sheet 5
PRESENT2: JP1.27 ; also sheet 5
PRESENT3: JP1.28 ; also sheet 5
PRESENT4: JP1.29 ; also sheet 5
PRESENT5: JP1.30 ; also sheet 5
SPI0_CLK: JP1.7 ; also sheet 5
SPI0_MISO: JP1.8 ; also sheet 5
SPI0_MOSI: JP1.9 ; also sheet 5
SPI1_CLK: JP1.10 ; also sheet 5
SPI1_MISO: JP1.11 ; also sheet 5
SPI1_MOSI: JP1.12 ; also sheet 5
SPI_IRQ0: JP1.19 ; also sheet 5
SPI_IRQ1: JP1.20 ; also sheet 5
SPI_IRQ2: JP1.21 ; also sheet 5
SPI_IRQ3: JP1.22 ; also sheet 5
SPI_IRQ4: JP1.23 ; also sheet 5
SPI_IRQ5: JP1.24 ; also sheet 5
SPI_SS0: JP1.13 ; also sheet 5
SPI_SS1: JP1.14 ; also sheet 5
SPI_SS2: JP1.15 ; also sheet 5
SPI_SS3: JP1.16 ; also sheet 5
SPI_SS4: JP1.17 ; also sheet 5
SPI_SS5: JP1.18 ; also sheet 5
VALID_RD: JP1.4 ; also sheet 5
VALID_WR: JP1.6 ; also sheet 5

### Buses
LO_VOLTAGE_BUS:LO_A[0..15],!LO_CCTL!,LO_CLK,LO_D[0..7],!LO_EXTSEL!,!LO_HALT!,!LO_IRQ!,!LO_MPD!,LO_RD4,LO_RD5,!LO_REF!,!LO_RST!,LO_R/!W!,!LO_S4!,!LO_S5!
PSPI:SPI0_CLK,SPI0_MISO,SPI0_MOSI,SPI1_CLK,SPI1_MISO,SPI1_MOSI,SPI_IRQ[0..5],SPI_SS[0..5]
PRESENT:PRESENT[0..5]
HBUS:HBUS[0..27]

## Power pins joined to a net without a drawn wire
GND: CN1.P$1(GND) CN1.P$2(GND) CN1.P$3(GND) CN1.P$4(GND)

## Library data of the parts
C1-C22 C57 C60 C63 C65 C67 C68 C71 C72 = rcl:C-EU: CAPACITOR, European symbol; SPICEPREFIX: C; USE: GRM033C71C104KE14D
CARTRIDGE = sjg-con:A8_CART; USE: 5650118-1
CN1 = microbuilder:HDMI_MOLEX_47151-0001; USE: 0471510001
D1 = microbuilder:DIODE: Diode SMA Model Volts Amps Type Vf Vr Digikey # Notes SSA34-E3 40V 3A Schottky 480mV @ 3A 200uA @ 40V SSA34-E3/61TGITR-ND CDBA120-G 20V 1A Schottky 500mV @ 1A 500uA @ 20V 641-1014-6-ND REEL MBRA210 10V 2A Schottky 350mV @ 2A 700uA @ 10V MBRA210LT3 SOD-123 Model Volts Amps Type Vf Vr Order # Notes BAT54T1G 30V 200mA Schottky 800mV @ 200mA 2uA @ 25V BAT54T1GOSTR-ND B0530W 30V 500mA Schottky 430mV @ 500mA 130uA @ 30V B0530W-FDICT-ND REEL MBR120 1A 20V Schottky 340mV @ 1A MBR120VLSFT1GOSCT-ND SOD-323 Model Volts Amps Type Vf Vr Order # Notes PMEG2005EJ 20V 500mA Schottky 355mV @ 500mA 568-4110-1-ND ZLLS410 10V 570mA Schottky 380mV @ 570mA ZLLS410CT-ND 1N4148WS 75V 150mA Silicon/Simple 1V 1N4148WSFSCT-ND REEL SOD-523 Model Volts Amps Type Vf Vr Order # Notes BAT54XV2 30V 200mA Schottky 0.8V @ 100mA BAT54XV2CT-ND TB751S 30V 30mA Schottky RB751S-40TE61CT-ND SOT23-R/W (R = Solder Paste/Reflow Ovens, W = Hand-Soldering) Model Volts Amps Type Vf Vr Order # Notes BAT54FILM 40V 300mA Schottky 497-7162-1-ND; USE: RB751V40,115
D2 = Seeed-LED:SMD-LED-CLEAR-RED(0805): 304090046; MPN: 17-215SURC/S530-A2/TR8; USE: 150080RS75000
IC1 = samacsys:SN74LVC2G07DCKR: Dual Buffer/Driver with Open-Drain Output Source: Datasheet <http://www.ti.com/lit/gpn/sn74lvc2g07>; DESCRIPTION: Dual Buffer/Driver with Open-Drain Output; HEIGHT: mm; MANUFACTURER_NAME: Texas Instruments; MANUFACTURER_PART_NUMBER: SN74LVC2G07DCKR; MOUSER_PART_NUMBER: 595-SN74LVC2G07DCKR; MOUSER_PRICE-STOCK: https://www.mouser.com/Search/Refine.aspx?Keyword=595-SN74LVC2G07DCKR; USE: SN74LVC2G07DCKR
IC2 = samacsys:SN74LVC1G07MDCKREP: Enhanced Product Single Buffer/Driver With Open-Drain Output Source: Datasheet <http://www.ti.com/general/docs/lit/getliterature.tsp?genericPartNumber=SN74LVC1G07-EP&fileType=pdf&HQS=ti-null-null-sf-df-pf-sep-wwe&DCM=yes>; DESCRIPTION: Enhanced Product Single Buffer/Driver With Open-Drain Output; HEIGHT: 1.1mm; MANUFACTURER_NAME: Texas Instruments; MANUFACTURER_PART_NUMBER: SN74LVC1G07MDCKREP; MOUSER_PART_NUMBER: 595-SN74LVC07MDCKREP; MOUSER_PRICE-STOCK: https://www.mouser.com/Search/Refine.aspx?Keyword=595-SN74LVC07MDCKREP; USE: SN74LVC1G07MDCKREP
IC3 = samacsys:NL17SZ126XV5T2G: Source: Datasheet <http://www.onsemi.com/pub/Collateral/NL17SZ126-D.PDF>; ALLIED_NUMBER: 70467362; ALLIED_PRICE-STOCK: http://www.alliedelec.com/on-semiconductor-nl17sz126xv5t2g/70467362/; HEIGHT: 0.6mm; MANUFACTURER_NAME: ON Semiconductor; MANUFACTURER_PART_NUMBER: NL17SZ126XV5T2G; MOUSER_PART_NUMBER: 863-NL17SZ126XV5T2G; MOUSER_PRICE-STOCK: https://www.mouser.com/Search/Refine.aspx?Keyword=863-NL17SZ126XV5T2G; RS_PART_NUMBER: 8054342P; RS_PRICE-STOCK: http://uk.rs-online.com/web/p/products/8054342P; USE: NL17SZ126XV5T2G
IC4 = samacsys:TPS2051BDBVR: TEXAS INSTRUMENTS - TPS2051BDBVR - CURRENT LIMITED POWER SWITCH, 5.5V SOT23-5, FULL REEL Source: Datasheet <http://www.ti.com/lit/ds/symlink/tps2051b.pdf>; DESCRIPTION: TEXAS INSTRUMENTS - TPS2051BDBVR - CURRENT LIMITED POWER SWITCH, 5.5V SOT23-5, FULL REEL; HEIGHT: 1.45mm; MANUFACTURER_NAME: Texas Instruments; MANUFACTURER_PART_NUMBER: TPS2051BDBVR; MOUSER_PART_NUMBER: 595-TPS2051BDBVR; MOUSER_PRICE-STOCK: https://www.mouser.com/Search/Refine.aspx?Keyword=595-TPS2051BDBVR; USE: TPS2051BDBVR
JP1-JP3 = pinhead-2:PINHD-2X15: PIN HEADER; USE: NPTC152KFMS-RC
LVL_AHI LVL_ALO LVL_D = sjg-logic:SN74LVC8T245; USE: SN74LVC8T245PWR
Q1 = samacsys:SMMBT3904LT1G: General Purpose Transistor NPN Silicon Source: Datasheet <http://www.onsemi.com/pub/Collateral/MMBT3904LT1-D.PDF>; ALLIED_NUMBER: 70600137; ALLIED_PRICE-STOCK: http://www.alliedelec.com/on-semiconductor-smmbt3904lt1g/70600137/; DESCRIPTION: General Purpose Transistor NPN Silicon; HEIGHT: 1.11mm; MANUFACTURER_NAME: ON Semiconductor; MANUFACTURER_PART_NUMBER: SMMBT3904LT1G; MOUSER_PART_NUMBER: 863-SMMBT3904LT1G; MOUSER_PRICE-STOCK: https://www.mouser.com/Search/Refine.aspx?Keyword=863-SMMBT3904LT1G; RS_PART_NUMBER: 8058870P; RS_PRICE-STOCK: http://uk.rs-online.com/web/p/products/8058870P; USE: SMMBT3904LT1G
R1 R6-R9 R11 R12 R14 = rcl:R-EU_: RESISTOR, European symbol; SPICEPREFIX: R; USE: RC0201FR-0749R9L
R2-R5 R10 R13 R19 R21 R22 R25 R26 R29 R31 R32 = rcl:R-EU_: RESISTOR, European symbol; SPICEPREFIX: R; USE: ERJ-1GNJ103C
R15 = rcl:R-EU_: RESISTOR, European symbol; SPICEPREFIX: R; USE: RC0201FR-0727KL
R16 R17 = rcl:R-EU_: RESISTOR, European symbol; SPICEPREFIX: R; USE: RC0201JR-071K5L
R18 R20 = rcl:R-EU_: RESISTOR, European symbol; SPICEPREFIX: R; USE: RC0201FR-074K7L
R23 R27 = rcl:R-EU_: RESISTOR, European symbol; SPICEPREFIX: R; USE: RC0201FR-07100KL
R24 R28 R30 = rcl:R-EU_: RESISTOR, European symbol; SPICEPREFIX: R; USE: RC0201FR-071KL
R33 = rcl:R-EU_: RESISTOR, European symbol; SPICEPREFIX: R; USE: RC0201JR-07820RL
U$1 = pbxl:BTH-060-01-F-D-A; USE: BTH-060-01-F-D-A
U$3 = sjg-con:MINI-SAS: Mini-SAS connector, right angle through hole Part 1888019-4 Digikey part A111092CT-ND; USE: 1888019-4
U$4-U$6 U$8 U$9 U$14-U$17 = sjg-logic:74LVC1T45GW; USE: 74LVCH1T45GS,132

## Net classes
1 Power: width 0.305 mm, drill 0.203 mm
2 Slot-power: width 0.508 mm
3 tx100: width 0.229 mm, clearance 0.203 mm
4 usb90: width 0.254 mm, clearance 0.178 mm
5 cclk50: width 0.203 mm
6 3v3: width 0.254 mm
7 vccint_aux: width 0.305 mm
14 qspi: width 0.203 mm